# Altium schematic sheet DC Engine and Servo Engine.SchDoc
size A; SheetNumber: 8; SheetTotal: 7
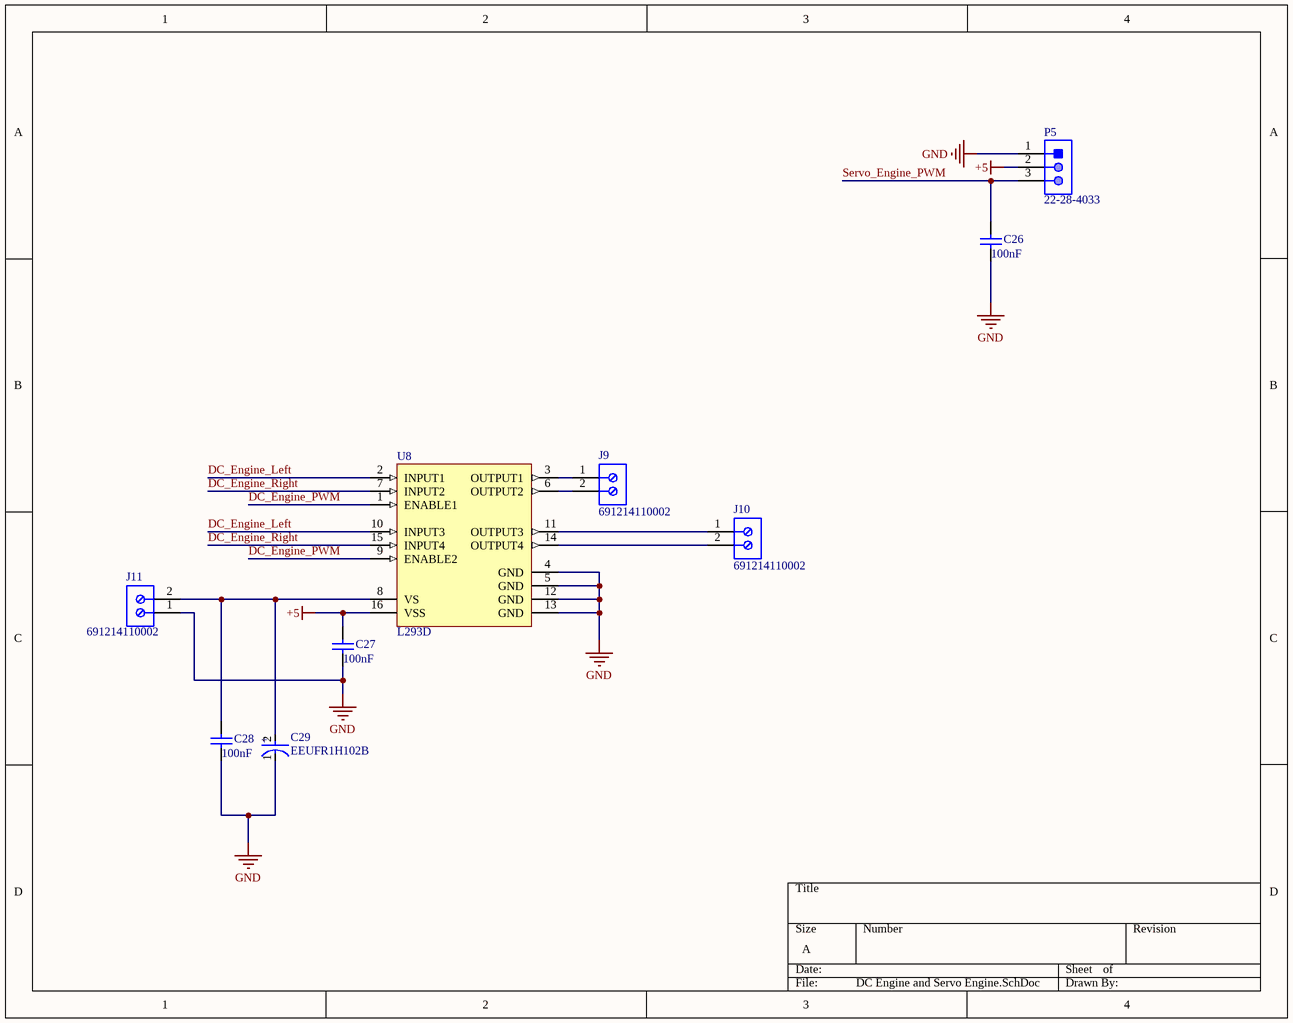
[diagram p0: DC Engine and Servo Engine.SchDoc]

## Parts
C26  value 100nF  [CAPC2013X135X45LL10T25]  (hidden comment: GRM21BR71H105KA12L)
C27  value 100nF  [CAPC2013X135X45LL10T25]  (hidden comment: GRM21BR71H105KA12L)
C28  value 100nF  [CAPC2013X135X45LL10T25]  (hidden comment: GRM21BR71H105KA12L)
C29  EEUFR1H102B  [FP-RAD-TH-D_16_0_5-L_25_2-MFG]
J9  691214110002  [691214110002]
J10  691214110002  [691214110002]
J11  691214110002  [691214110002]
P5  22-28-4033  [MOLX-22-28-4033_V]
U8  L293D  [STM-L293D-16]

## Nets
+5: C27.2 P5.2 U8.16(VSS)
GND: C26.1 C27.1 C28.1 C29.1(C) J11.1 P5.1 U8.4(GND) U8.5(GND) U8.12(GND) U8.13(GND)
DC_Engine_Left: U8.2(INPUT1) U8.10(INPUT3)
DC_Engine_PWM: U8.1(ENABLE1) U8.9(ENABLE2)
DC_Engine_Right: U8.7(INPUT2) U8.15(INPUT4)
Servo_Engine_PWM: C26.2 P5.3
NetC28_2: C28.2 C29.2(A) J11.2 U8.8(VS)
NetJ9_1: J9.1 U8.3(OUTPUT1)
NetJ9_2: J9.2 U8.6(OUTPUT2)
NetJ10_1: J10.1 U8.11(OUTPUT3)
NetJ10_2: J10.2 U8.14(OUTPUT4)

## Notes on the sheet
- (in symbol CMP-05427-000487-1) +

## Library data of the parts
C26-C28 = CMP-1036-04761-2: Manufacturer: Murata; Part Number: GRM21BR71H105KA12L
C29 = CMP-05427-000487-1: Aluminum Electrolytic Capacitors (Radial Lead Type) 1000uF ±20% 50V; Ripple Current: 3.32A; Impedance: 16mR; Polarity: Polar; Life (Hours): 10000Hour; Capacitance: 1mF; Lead Diameter: 0.8mm; Mount: Through Hole; Series: FR; Package Quantity: 250; Length: 25mm; Radiation Hardening: No; REACH SVHC: No SVHC; Case/Package: Radial; Height: 25mm; Min Operating Temperature: -40°C; Contact Plating: Tin; Lead Free: Lead Free; Height - Seated (Max): 0.984inch; RoHS Compliant: Yes; Features: General Purpose; ESR (Equivalent Series Resistance): 16mR; Voltage Rating: 50V; Diameter: 16mm; Voltage Rating (DC): 50V; Max Operating Temperature: 105°C; Lead Pitch: 7.5mm; Packaging: Tape and Reel; Number of Pins: 2; Tolerance: 20%; Termination: Through Hole
J9-J11 = CMP-1502-02464-1: Serie 2141 - 3.50 mm Horizontal Entry Modular with Rising Cage Clamp WR-TBL, 2 pin; Manufacturer: Wurth Elektronik; Pin Number: 2; Pitch: 3.50mm; Datasheet URL: http://katalog.we-online.de/em/datasheet/6912141100xx.pdf; Packaging: Box; Mounting Technology: THT; Package Reference: 691214110002; Manufacturer URL: http://www.we-online.de; Part Number: 691214110002; Publisher: WurthElektronik; Operating Temperature: -40to105degC
P5 = CMP-1676-00001-5: Male Header, Pitch 2.54 mm, 1 x 3 Position, Height 8.38 mm, Tail Length 3.18 mm, RoHS, Bulk; Manufacturer: Molex; Rows: 1; Voltage Rating: 250 V; Current Rating: 4 A; Min Operating Temperature: 0 degC; Lead Pitch: 0.1 inch; Packaging: Bulk; Contact Finish: Gold; RoHSCompliant: true; Contact Material: Brass; PackageReference: 22-28-4033; REACH SVHC: Unknown; PackageDescription: Male Header, Pitch 2.54 mm, 1 x 3 Position, Height 8.38 mm, Tail Length 3.18 mm; ComponentLink2URL: http://www.molex.com/pdm_docs/sd/022284033_sd.pdf; Height: 8.38 mm; Mounting Technology: Through Hole; ComponentLink1Description: Manufacturer URL; Length: 7.62 mm; Mount: Through Hole; DatasheetVersion: Rev. G, 01/2012; Max Operating Temperature: 75 degC; ComponentLink2Description: Datasheet; Colour: Black; Pins: 3; Contact Plating: Gold; Package Quantity: 1; ComponentLink1URL: http://www.molex.com/
U8 = CMP-2000-06524-1: Push-Pull Four Channel Driver with Diode, 4.5 to 36 V, -40 to 150 degC, 16-Pin PDIP, RoHS, Tube; Manufacturer: STMicroelectronics; Number of Outputs: 4; Current - Peak Output: 1.2A; Current - Output / Channel: 600mA; Input Type: Non-Inverting; Other Related Documents: L293DViewAllSpecifications; Dynamic Catalog: HalfBridge; Voltage - Supply: 4.5V~36V; Other Names: 497-2936-5; Package / Case: 16-DIP(0.300",7.62mm); PartNumber: L293D; Operating Temperature: -40°C~150°C; Datasheet URL: http://www.st.com/st-web-ui/static/active/en/resource/technical/document/datasheet/CD00000059.pdf; Supplier Device Package: 16-PowerDIP; Packaging: Tube; Package Description: 16-Pin Thru-Hole Dual-In-Line, Body 20 x 6.85 mm, Pitch 2.54 mm; Standard Package: 25; Datasheet Version: 07/2003; On-State Resistance: -; Manufacturer URL: http://www.st.com/; Category: IntegratedCircuits(ICs); Family: PMIC-MOSFET,BridgeDrivers-InternalSwitch; Type: HalfBridge; Series: -; Mounting Technology: ThroughHole; Package Reference: DIP-16; Mounting Type: ThroughHole